# Altium schematic sheet VGA.SchDoc
size A3
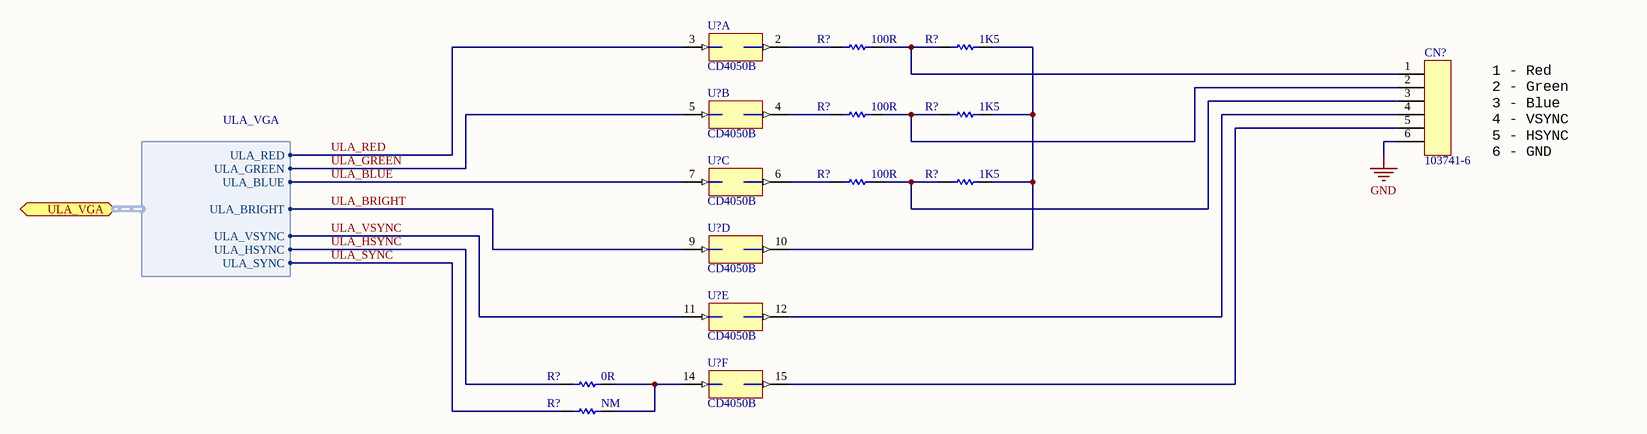
[diagram p0: VGA.SchDoc]

## Parts
(Parts that share a designator on the sheet are numbered #1, #2 ... from top to bottom, then left to right.)
CN?  103741-6  [103741-6]
R?#1  100R  [0805]
R?#2  1K5  [0805]
R?#3  100R  [0805]
R?#4  1K5  [0805]
R?#5  100R  [0805]
R?#6  1K5  [0805]
R?#7  0R  [0805]
R?#8  NM  [0805]
U?#1  CD4050B  [TSSOP16]  (part A of 7)
U?#2  CD4050B  [TSSOP16]  (part B of 7)
U?#3  CD4050B  [TSSOP16]  (part C of 7)
U?#4  CD4050B  [TSSOP16]  (part D of 7)
U?#5  CD4050B  [TSSOP16]  (part E of 7)
U?#6  CD4050B  [TSSOP16]  (part F of 7)

## Ports
ULA_VGA (harness ULA_VGA)

## Harnesses
ULA_VGA: ULA_BLUE, ULA_RED, ULA_GREEN, ULA_BRIGHT, ULA_HSYNC, ULA_VSYNC, ULA_SYNC

## Nets
GND: CN?.6
ULA_BLUE: U?#3.7(A) ; port ULA_VGA.ULA_BLUE
ULA_BRIGHT: U?#4.9(A) ; port ULA_VGA.ULA_BRIGHT
ULA_GREEN: U?#2.5(A) ; port ULA_VGA.ULA_GREEN
ULA_HSYNC: R?#7.2 ; port ULA_VGA.ULA_HSYNC
ULA_RED: U?#1.3(A) ; port ULA_VGA.ULA_RED
ULA_SYNC: R?#8.2 ; port ULA_VGA.ULA_SYNC
ULA_VSYNC: U?#5.11(A) ; port ULA_VGA.ULA_VSYNC
NetCN?_1: CN?.1 R?#1.1 R?#2.2
NetCN?_2: CN?.2 R?#3.1 R?#4.2
NetCN?_3: CN?.3 R?#5.1 R?#6.2
NetCN?_4: CN?.4 U?#5.12(Y)
NetCN?_5: CN?.5 U?#6.15(Y)
NetR?#1_2: R?#1.2 U?#1.2(Y)
NetR?#2_1: R?#2.1 R?#4.1 R?#6.1 U?#4.10(Y)
NetR?#3_2: R?#3.2 U?#2.4(Y)
NetR?#5_2: R?#5.2 U?#3.6(Y)
NetR?#7_1: R?#7.1 R?#8.1 U?#6.14(A)

## Notes on the sheet
- 1 - Red
  2 - Green
  3 - Blue
  4 - VSYNC
  5 - HSYNC
  6 - GND

## Library data of the parts
CN? = 103741-6: CONN Breakaway Single Row
R?#1-R?#8 = Resistor
U?#1-U?#6 = CD4050B: CMOS Hex Buffers/Converters Non-Inverting Type